# EAGLE design beatrix_A_v1 (EAGLE 9.6.2)
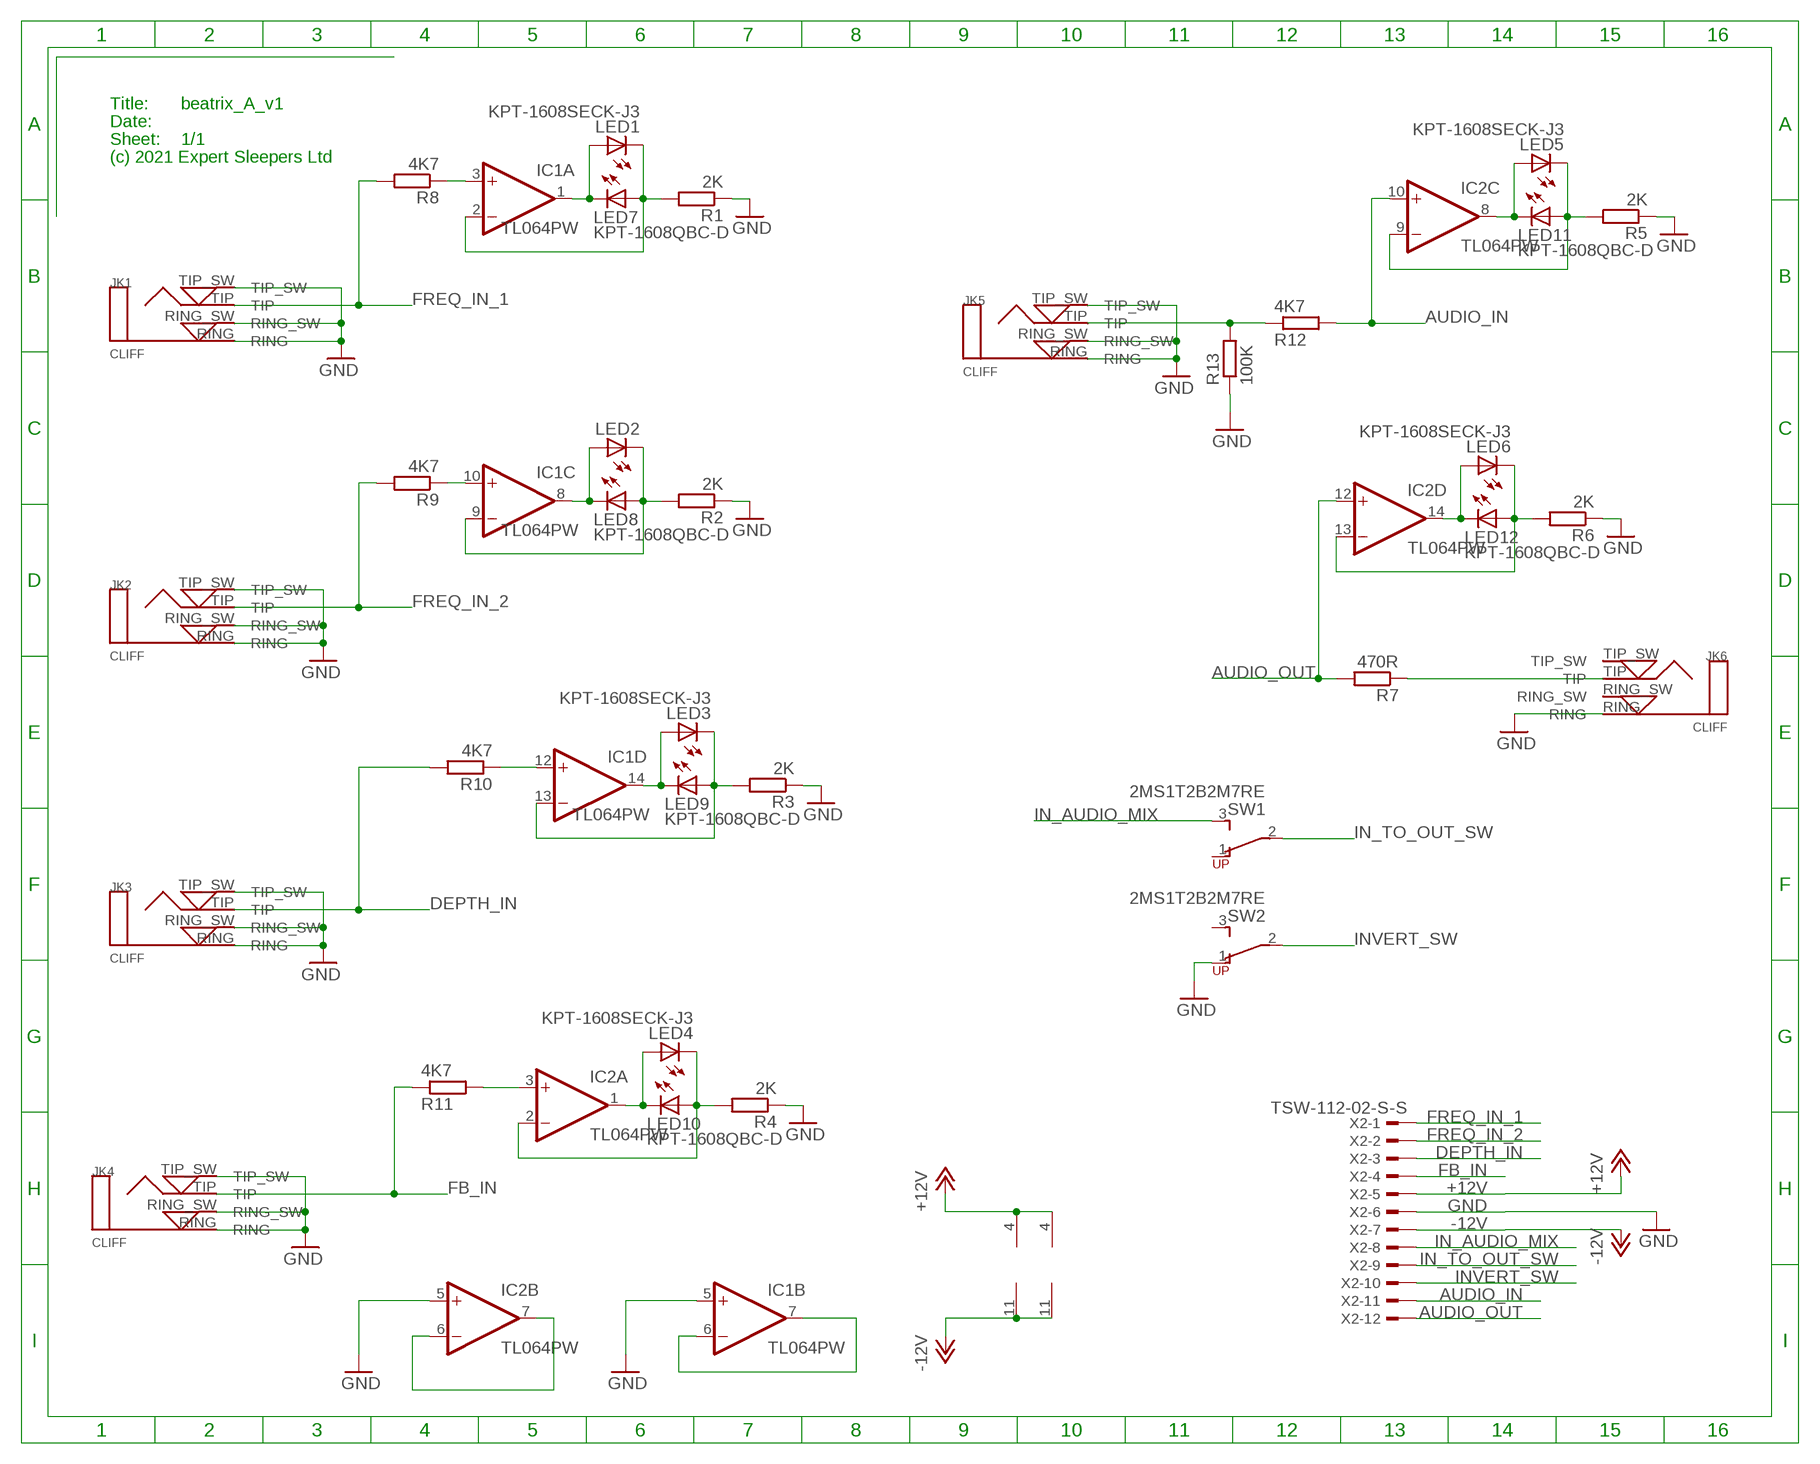
[diagram p0: schematic, sheet 1]

## Parts
IC1  TL064PW  TL074PW  [PW_R-PDSO-G14]
IC2  TL064PW  TL074PW  [PW_R-PDSO-G14]
JK1  CLIFF  CLIFF3.5MM_PCB_SW_JK  [CLIFF3.5MMPCB]
JK2  CLIFF  CLIFF3.5MM_PCB_SW_JK  [CLIFF3.5MMPCB]
JK3  CLIFF  CLIFF3.5MM_PCB_SW_JK  [CLIFF3.5MMPCB]
JK4  CLIFF  CLIFF3.5MM_PCB_SW_JK  [CLIFF3.5MMPCB]
JK5  CLIFF  CLIFF3.5MM_PCB_SW_JK  [CLIFF3.5MMPCB]
JK6  CLIFF  CLIFF3.5MM_PCB_SW_JK  [CLIFF3.5MMPCB]
LED1  KPT-1608SECK-J3  [CHIPLED_0603_LEFT]
LED2  KPT-1608SECK-J3  [CHIPLED_0603_LEFT]
LED3  KPT-1608SECK-J3  [CHIPLED_0603_LEFT]
LED4  KPT-1608SECK-J3  [CHIPLED_0603_LEFT]
LED5  KPT-1608SECK-J3  [CHIPLED_0603_LEFT]
LED6  KPT-1608SECK-J3  [CHIPLED_0603_LEFT]
LED7  KPT-1608QBC-D  [CHIPLED_0603_RIGHT]
LED8  KPT-1608QBC-D  [CHIPLED_0603_RIGHT]
LED9  KPT-1608QBC-D  [CHIPLED_0603_RIGHT]
LED10  KPT-1608QBC-D  [CHIPLED_0603_RIGHT]
LED11  KPT-1608QBC-D  [CHIPLED_0603_RIGHT]
LED12  KPT-1608QBC-D  [CHIPLED_0603_RIGHT]
R1  2K  R-EU_R1206  [R1206]
R2  2K  R-EU_R1206  [R1206]
R3  2K  R-EU_R1206  [R1206]
R4  2K  R-EU_R1206  [R1206]
R5  2K  R-EU_R1206  [R1206]
R6  2K  R-EU_R1206  [R1206]
R7  470R  R-EU_R1206  [R1206]
R8  4K7  R-EU_R1206  [R1206]
R9  4K7  R-EU_R1206  [R1206]
R10  4K7  R-EU_R1206  [R1206]
R11  4K7  R-EU_R1206  [R1206]
R12  4K7  R-EU_R1206  [R1206]
R13  100K  R-EU_R0603  [R0603]
SW1  2MS1T2B2M7RE  [2MS1T2B2M7RE]
SW2  2MS1T2B2M7RE  [2MS1T2B2M7RE]
X2  TSW-112-02-S-S  [TSW-112-02-S-S]

## Nets
+12V: IC1.4(P:V+) IC2.4(P:V+) X2.5
-12V: IC1.11(P:V-) IC2.11(P:V-) X2.7
AUDIO_IN: IC2.10(C:+IN) R12.2 X2.11
AUDIO_OUT: IC2.12(D:+IN) R7.2 X2.12
DEPTH_IN: JK3.TIP R10.2 X2.3
FB_IN: JK4.TIP R11.1 X2.4
FREQ_IN_1: JK1.TIP R8.2 X2.1
FREQ_IN_2: JK2.TIP R9.2 X2.2
GND [power]: IC1.5(B:+IN) IC2.5(B:+IN) JK1.RING JK1.RING_SW JK1.TIP_SW JK2.RING JK2.RING_SW JK2.TIP_SW JK3.RING JK3.RING_SW JK3.TIP_SW JK4.RING JK4.RING_SW JK4.TIP_SW JK5.RING JK5.RING_SW JK5.TIP_SW JK6.RING R1.1 R2.1 R3.1 R4.1 R5.1 R6.1 R13.1 SW2.1(RU) X2.6
IN_AUDIO_MIX: SW1.3(RD) X2.8
IN_TO_OUT_SW: SW1.2(PR) X2.9
INVERT_SW: SW2.2(PR) X2.10
N$6: IC2.6(B:-IN) IC2.7(B:OUT)
N$8: IC1.12(D:+IN) R10.1
N$11: IC1.14(D:OUT) LED3.2(A) LED9.2(C)
N$16: IC1.10(C:+IN) R9.1
N$17: IC1.13(D:-IN) LED3.1(C) LED9.1(A) R3.2
N$19: IC1.1(A:OUT) LED1.2(A) LED7.2(C)
N$22: IC1.2(A:-IN) LED1.1(C) LED7.1(A) R1.2
N$25: IC1.3(A:+IN) R8.1
N$29: IC1.8(C:OUT) LED2.2(A) LED8.2(C)
N$30: IC1.9(C:-IN) LED2.1(C) LED8.1(A) R2.2
N$33: IC1.6(B:-IN) IC1.7(B:OUT)
N$47: IC2.3(A:+IN) R11.2
N$62: IC2.8(C:OUT) LED5.2(A) LED11.2(C)
N$63: IC2.9(C:-IN) LED5.1(C) LED11.1(A) R5.2
N$65: IC2.14(D:OUT) LED6.2(A) LED12.2(C)
N$66: IC2.13(D:-IN) LED6.1(C) LED12.1(A) R6.2
N$71: IC2.1(A:OUT) LED4.2(A) LED10.2(C)
N$72: IC2.2(A:-IN) LED4.1(C) LED10.1(A) R4.2
N$75: JK5.TIP R12.1 R13.2
N$76: JK6.TIP R7.1
Unconnected: JK6.RING_SW JK6.TIP_SW SW1.1(RU) SW2.3(RD)

## Notes on the sheet
- Title:
- Date:
- Sheet:
- (c) 2021 Expert Sleepers Ltd

## Library data of the parts
IC1 IC2 = digital-audio:TL074: OP AMP
JK1-JK6 = cliff:CLIFF3.5MM_PCB_SW_JK: Cliff 3.5mm Mono PCB switched jack socket
LED1-LED6 = kingbright:KPT-1608SECK-J3
LED7-LED12 = kingbright:KPT-1608QBC-D
R1-R13 = rcl:R-EU_: RESISTOR, European symbol
SW1 SW2 = switch-multicomp:2MS1T2B2M7RE
X2 = con-samtec:TSW-112-02-S-S: THROUGH-HOLE .025" SQ POST HEADER Source: Samtec TSW.pdf; OC_FARNELL: unknown; OC_NEWARK: unknown

## Board
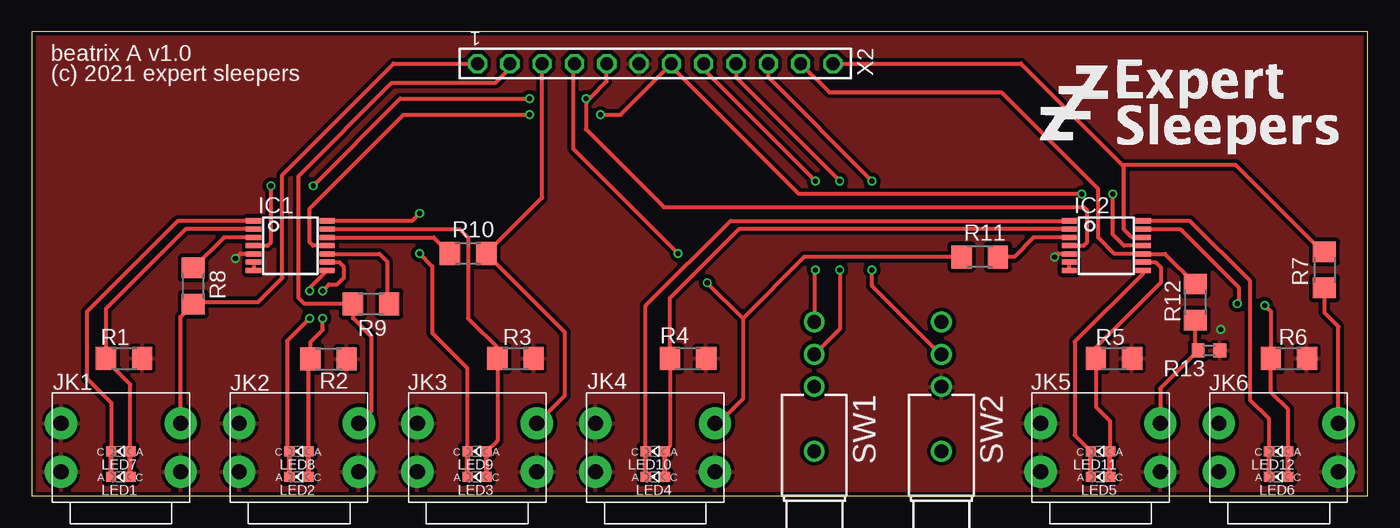
[diagram p1: board, top side]
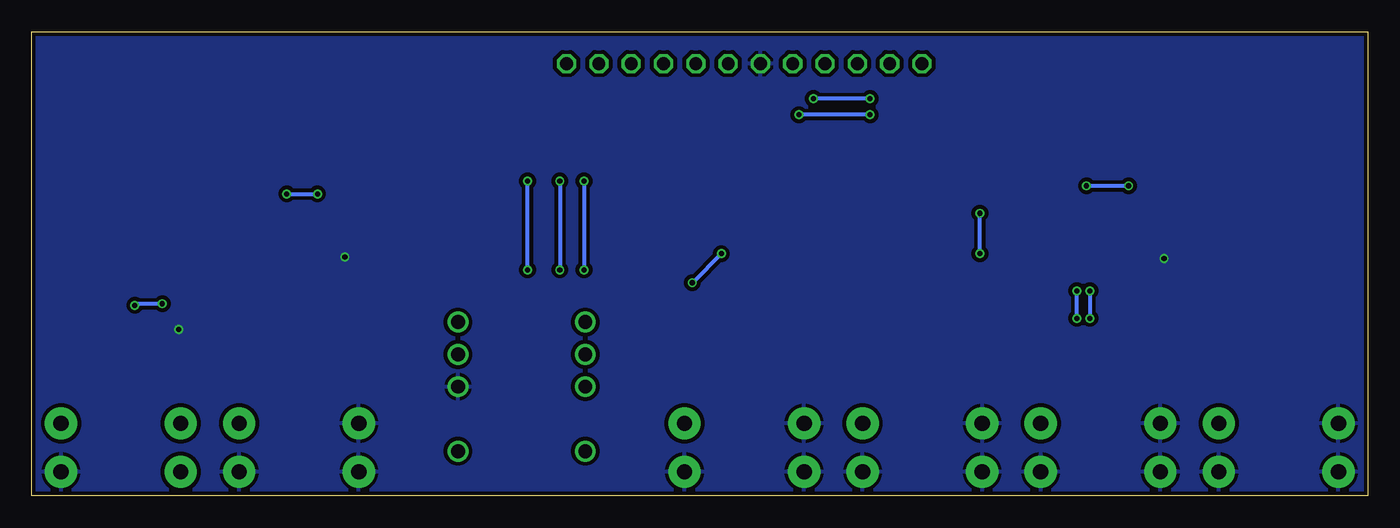
[diagram p2: board, bottom side, seen from below]

Size 105 x 36.5 mm. Coordinates in mm from the lower left corner, seen from the top.
Outline: 0,0 105,0 105,36.5 0,36.5 0,0
Copper layers (1*16): Top 0.035mm / dielectric 1.5mm / Bottom 0.035mm
Design rules "pcbtrain *": minimum track width 0.125mm, minimum drill 0.3mm, track to track 0.125mm, track to pad 0.125mm, pad to pad 0.125mm, via to via 0.125mm, smd to smd 0.125mm, copper to edge 0.25mm, drill to drill 8mil, minimum pad ring 0.15mm, minimum via ring 0.15mm, stop-mask expansion 4mil, vias tented up to drill 0mil, thermal gap 10mil

### Footprints (pad centres in the part's own frame; a part is rotated, then mirrored left to right if it is on the bottom)
PW_R-PDSO-G14 = smd 0.4 x 1.2: 1 -1.95,-2.9; 2 -1.3,-2.9; 3 -0.65,-2.9; 4 0,-2.9; 5 0.65,-2.9; 6 1.3,-2.9; 7 1.95,-2.9; 8 1.95,2.9; 9 1.3,2.9; 10 0.65,2.9; 11 0,2.9; 12 -0.65,2.9; 13 -1.3,2.9; 14 -1.95,2.9
CLIFF3.5MMPCB = drill 1.2 pad 2.54: RING 4.7,-1.9; RING_SW -4.7,-1.9; TIP 4.7,1.9; TIP_SW -4.7,1.9
CHIPLED_0603_LEFT = smd 0.8 x 0.8: 1 0,-0.75; 2 0,0.75
CHIPLED_0603_RIGHT = smd 0.8 x 0.8: 1 0,-0.75; 2 0,0.75
R1206 = smd 1.6 x 1.803: 1 -1.422,0; 2 1.422,0
R0603 = smd 1 x 1.1: 1 -0.85,0; 2 0.85,0
2MS1T2B2M7RE = drill 1.092: 1 0,5.08; 2 0,7.62; 3 0,10.16; 7 0,0
TSW-112-02-S-S = drill 1 pad 1.5 octagon: 1 13.97,0; 2 11.43,0; 3 8.89,0; 4 6.35,0; 5 3.81,0; 6 1.27,0; 7 -1.27,0; 8 -3.81,0; 9 -6.35,0; 10 -8.89,0; 11 -11.43,0; 12 -13.97,0

### Placement (x,y rotation side)
IC1  20.32,19.68 270 top
IC2  84.45,19.68 270 top
JK1  7,3.8 0 top
JK2  21,3.8 0 top
JK3  35,3.8 0 top
JK4  49,3.8 0 top
JK5  84,3.8 0 top
JK6  98,3.8 0 top
LED1  7,1.5 90 top
LED2  21,1.5 90 top
LED3  35,1.5 90 top
LED4  49,1.5 90 top
LED5  84,1.5 90 top
LED6  98,1.5 90 top
LED7  7,3.5 90 top
LED8  21,3.5 90 top
LED9  35,3.5 90 top
LED10  49,3.5 90 top
LED11  84,3.5 90 top
LED12  98,3.5 90 top
R1  7.25,10.81 180 top
R2  23.32,10.78 180 top
R3  38.02,10.81 180 top
R4  51.58,10.81 180 top
R5  85.06,10.81 180 top
R6  98.81,10.81 180 top
R7  101.6,17.78 90 top
R8  12.7,16.51 270 top
R9  26.66,15.11 180 top
R10  34.29,19.05 0 top
R11  74.51,18.8 0 top
R12  91.44,15.24 90 top
R13  92.52,11.42 180 top
SW1  61.5,3.51 0 top
SW2  71.5,3.51 0 top
U$1  [ES_ZZZ_TEXT_TPLACE_1IN_600DPI]  78.28,26.45 0 top
X2  49,34 180 top

### Tracks (layer width: path | path; a pad name or v marks a point on that pad's centre or on a via)
+12V  (via drill 0.4)
  Top 0.305: IC1.4 18.54,19.68 18.8,19.94 v18.8,24.38 | v22.1,24.38 28.96,31.24 v39.12,31.24 | IC2.4 82.68,19.68 82.93,19.94 82.93,22.48 82.7,22.71 49.68,22.71 43.56,28.83 v43.56,31.24 43.83,31.24 45.19,32.6 X2.5
  Bottom 0.305: v18.8,24.38 v22.1,24.38 | v39.12,31.24 v43.56,31.24
-12V  (via drill 0.4)
  Top 0.305: IC1.11 22.1,19.68 21.84,19.94 21.84,22.61 29.21,29.97 v39.12,29.97 | IC2.11 85.85,19.68 84.96,20.57 v84.96,23.75 | X2.7 50.29,33.98 | 50.29,33.98 50.29,33.76 60.3,23.75 v82.55,23.75 | v44.7,29.97 46.29,29.97 50.29,33.98
  Bottom 0.305: v39.12,29.97 v44.7,29.97 | v84.96,23.75 v82.55,23.75
AUDIO_IN
  Top 0.305: R12.2 89.07,19.04 IC2.10 85.11,19.04 83.82,20.32 83.82,24.13 76.2,31.75 62.68,31.75 X2.11
AUDIO_OUT
  Top 0.305: R7.2 101.45,19.2 94.61,26.04 85.85,26.04 | IC2.12 86.47,20.34 85.85,20.95 85.85,26.04 | 85.85,26.04 85.72,26.04 77.76,34 X2.12
DEPTH_IN
  Top 0.305: X2.3 40.11,23.45 R10.2 41.91,12.85 41.91,7.91 JK3.TIP
FB_IN  (via drill 0.4)
  Top 0.305: R11.1 60.71,18.8 55.88,13.97 | 55.88,13.97 55.88,7.62 53.96,5.7 JK4.TIP | X2.4 42.65,33.76 42.55,33.66 42.55,27.3 v50.8,19.05 | v53.09,16.76 55.88,13.97
  Bottom 0.305: v50.8,19.05 v53.09,16.76
FREQ_IN_1
  Top 0.305: JK1.TIP 11.7,14.09 R8.2 12.85,15.24 17.78,15.24 19.68,17.14 19.68,25.25 28.43,34 X2.1
FREQ_IN_2
  Top 0.305: X2.2 37.57,33.61 36.45,32.49 28.3,32.49 20.95,25.15 20.95,15.58 21.43,15.11 R9.2 25.24,13.98 26.67,12.55 26.67,6.67 JK2.TIP
GND  (via drill 0.4)
  Top 0.305: IC2.5 80.63,19.04 v80.39,18.8 | IC1.5 16.37,19.04 v16,18.67
  other vias: 93.44,13.09
  pour Top (isolate 0.305): 0,0 105,0 105,36.5 0,36.5
  pour Bottom (isolate 0.305): 0,0 105,0 105,36.5 0,36.5
IN_AUDIO_MIX  (via drill 0.4)
  Top 0.305: X2.8 52.81,33.55 v61.59,24.77 | v61.59,17.78 61.5,17.68 SW1.3
  Bottom 0.305: v61.59,24.77 v61.59,17.78
IN_TO_OUT_SW  (via drill 0.4)
  Top 0.305: X2.9 55.35,32.91 v63.5,24.77 | v63.5,17.78 63.5,13.13 SW1.2
  Bottom 0.305: v63.5,24.77 v63.5,17.78
INVERT_SW  (via drill 0.4)
  Top 0.305: SW2.2 71.42,11.13 66.04,16.51 v66.04,17.78 | v66.04,24.77 57.89,32.91 X2.10
  Bottom 0.305: v66.04,17.78 v66.04,24.77
N$6
  Top 0.305: IC2.7 IC2.6
N$8
  Top 0.305: IC1.12 31.58,20.34 R10.1
N$11  (via drill 0.4)
  Top 0.305: LED9.2 34.25,10.04 31.48,12.81 31.48,18.05 v30.48,19.05 | v30.48,22.23 29.89,21.64 IC1.14
  Top 0.406: LED3.2 LED9.2
  Bottom 0.305: v30.48,19.05 v30.48,22.23
N$16
  Top 0.305: R9.1 27.94,15.25 27.94,18.41 27.32,19.04 IC1.10
N$17
  Top 0.305: IC1.13 33.62,20.98 34.29,20.32 34.29,13.97 36.83,11.43 36.83,10.39 36.6,10.16 | R3.2 36.6,10.16 | 36.6,10.16 36.6,4.35 LED9.1
  Top 0.406: LED3.1 LED9.1
N$19
  Top 0.305: IC1.1 11.47,21.64 4.32,14.48 4.32,9.24 6.25,7.31 LED7.2
  Top 0.406: LED1.2 LED7.2
N$22
  Top 0.305: LED7.1 7.75,8.76 6.35,10.16 | IC1.2 12.1,20.98 5.83,14.72 R1.2
  Top 0.406: LED1.1 LED7.1 | 6.35,10.16 6.35,10.29 R1.2
N$25
  Top 0.305: IC1.3 15.1,20.34 R8.1
N$29  (via drill 0.4)
  Top 0.305: IC1.8 21.84,16.36 v21.84,16.13 | LED8.2 20.05,3.7 20.05,12.18 v21.84,13.97
  Top 0.406: LED2.2 LED8.2
  Bottom 0.305: v21.84,16.13 v21.84,13.97
N$30  (via drill 0.4)
  Top 0.305: v22.86,16.13 23.37,16.64 24,16.64 24.51,17.14 24.51,18.03 24.16,18.39 IC1.9 | LED8.1 21.75,10.63 R2.2 21.9,12.1 22.86,13.06 v22.86,13.97
  Top 0.406: LED2.1 LED8.1
  Bottom 0.305: v22.86,13.97 v22.86,16.13
N$33
  Top 0.305: IC1.6 IC1.7
N$47
  Top 0.305: IC2.3 78.74,20.32 77.22,18.8 R11.2
N$62
  Top 0.305: IC2.8 87.36,17.5 81.98,12.13 81.98,4.77 LED11.2
  Top 0.406: LED5.2 LED11.2
N$63
  Top 0.305: IC2.9 88.3,18.39 88.77,17.91 88.77,16.82 83.64,11.68 R5.2 83.64,7 84.75,5.89 LED11.1
  Top 0.406: LED5.1 LED11.1
N$65
  Top 0.305: LED12.2 97.25,6.04 95.76,7.53 95.76,16.89 91.01,21.64 IC2.14
  Top 0.406: LED6.2 LED12.2
N$66  (via drill 0.4)
  Top 0.305: IC2.13 90.27,20.98 94.87,16.38 94.87,15.24 v94.74,15.11 | v96.9,14.99 97.38,14.5 R6.2 97.38,8.15 98.75,6.79 LED12.1
  Top 0.406: LED6.1 LED12.1
  Bottom 0.305: v94.74,15.11 96.77,15.11 v96.9,14.99
N$71
  Top 0.305: IC2.1 54.92,21.64 48.25,14.96 LED10.2
  Top 0.406: LED4.2 LED10.2
N$72
  Top 0.305: IC2.2 55.59,20.98 50.16,15.55 R4.2 50.16,3.91 LED10.1
  Top 0.406: LED4.1 LED10.1
N$75
  Top 0.305: R12.1 91.44,11.65 R13.2 88.7,8.46 JK5.TIP
N$76
  Top 0.305: JK6.TIP 102.7,13.32 101.6,14.42 R7.1

### Text on the board
tPlace: beatrix A v1.0 | (c) 2021 expert sleepers